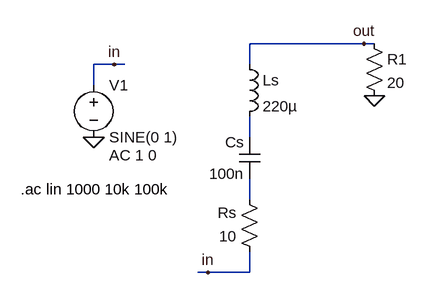
[diagram p0: schematic RLC.asc]
RLC.asc, the LTspice schematic file:
Version 4
SHEET 1 880 680
WIRE 304 96 128 96
WIRE 320 96 304 96
WIRE -80 128 -112 128
WIRE -64 128 -80 128
WIRE 128 128 128 96
WIRE -112 160 -112 128
WIRE 128 240 128 208
WIRE 128 336 128 304
WIRE 64 448 48 448
WIRE 128 448 128 416
WIRE 128 448 64 448
FLAG -80 128 in
FLAG 304 96 out
FLAG -112 240 0
FLAG 64 448 in
FLAG 320 176 0
SYMBOL cap 144 304 R180
WINDOW 0 24 56 Left 2
WINDOW 3 24 8 Left 2
SYMATTR InstName Cs
SYMATTR Value 100n
SYMBOL res 144 432 R180
WINDOW 0 36 76 Left 2
WINDOW 3 36 40 Left 2
SYMATTR InstName Rs
SYMATTR Value 10
SYMBOL ind 112 112 R0
SYMATTR InstName Ls
SYMATTR Value 220µ
SYMBOL voltage -112 144 R0
WINDOW 123 24 124 Left 2
WINDOW 39 0 0 Left 0
SYMATTR Value2 AC 1 0
SYMATTR InstName V1
SYMATTR Value SINE(0 1)
SYMBOL res 304 80 R0
SYMATTR InstName R1
SYMATTR Value 20
TEXT -224 320 Left 2 !.ac lin 1000 10k 100k

The netlist it stands for:
* RLC.asc
Cs N002 N001 100n
Rs in N002 10
Ls out N001 220µ
V1 in 0 SINE(0 1) AC 1 0
R1 out 0 20
.ac lin 1000 10k 100k
.backanno
.end